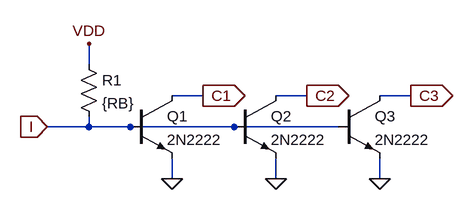
[diagram p0: schematic iilg3.asc]
iilg3.asc, the LTspice schematic file:
Version 4
SHEET 1 956 680
WIRE 384 240 384 208
WIRE 560 288 512 288
WIRE 720 288 672 288
WIRE 880 288 832 288
WIRE 384 336 384 320
WIRE 384 336 320 336
WIRE 448 336 384 336
WIRE 608 336 448 336
WIRE 768 336 608 336
WIRE 512 416 512 384
WIRE 672 416 672 384
WIRE 832 416 832 384
FLAG 384 208 VDD
FLAG 320 336 I
IOPIN 320 336 In
FLAG 512 416 0
FLAG 560 288 C1
IOPIN 560 288 Out
FLAG 672 416 0
FLAG 720 288 C2
IOPIN 720 288 Out
FLAG 832 416 0
FLAG 880 288 C3
IOPIN 880 288 Out
SYMBOL npn 448 288 R0
SYMATTR InstName Q1
SYMATTR Value 2N2222
SYMBOL res 368 224 R0
SYMATTR InstName R1
SYMATTR Value {RB}
SYMBOL npn 608 288 R0
SYMATTR InstName Q2
SYMATTR Value 2N2222
SYMBOL npn 768 288 R0
SYMATTR InstName Q3
SYMATTR Value 2N2222

The netlist it stands for:
* iilg3.asc
Q1 C1 I 0 0 2N2222
R1 VDD I {RB}
Q2 C2 I 0 0 2N2222
Q3 C3 I 0 0 2N2222
.model NPN NPN
.model PNP PNP
.lib standard.bjt
.backanno
.end